# EAGLE design PE01 (EAGLE 6.3)
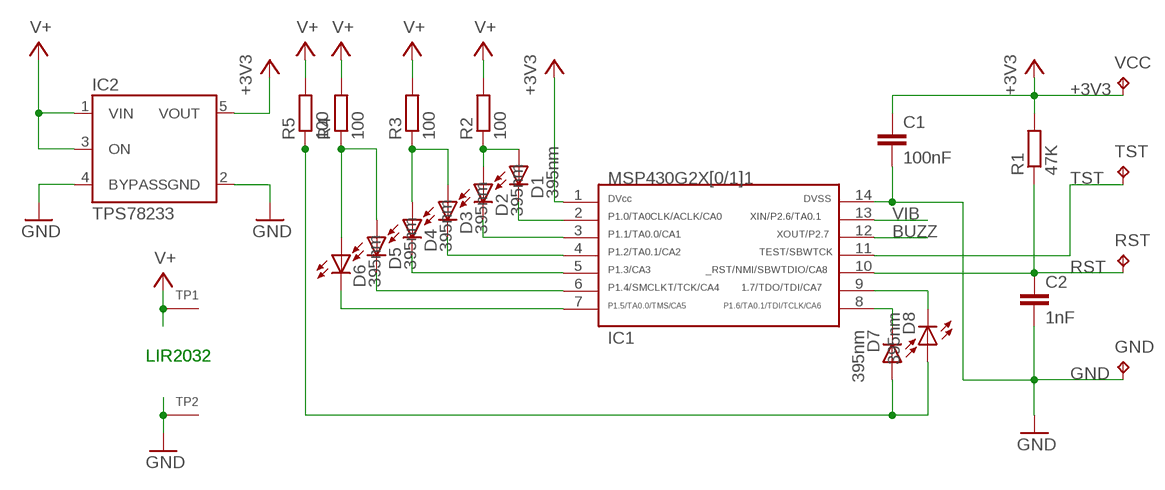
[diagram p0: schematic, sheet 1]

## Parts
C1  100nF  CAP0805  [0805]
C2  1nF  CAP0805  [0805]
D1  395nm  LED-3MM  [LED-3MM]
D2  395nm  LED-3MM  [LED-3MM]
D3  395nm  LED-3MM  [LED-3MM]
D4  395nm  LED-3MM  [LED-3MM]
D5  395nm  LED-3MM  [LED-3MM]
D6  395nm  LED-3MM  [LED-3MM]
D7  395nm  LED-3MM  [LED-3MM]
D8  395nm  LED-3MM  [LED-3MM]
GND  TPTP10R  [TP10R]
IC1  MSP430G2231  G2X[0/1]1---PW14  [PW14]
IC2  TPS78233  LP2982M5  [SOT23-5]
R1  47K  R-EU_R0603  [R0603]
R2  100  R-EU_R0603  [R0603]
R3  100  R-EU_R0603  [R0603]
R4  100  R-EU_R0603  [R0603]
R5  100  R-EU_R0603  [R0603]
RST  TPTP10R  [TP10R]
TP1  SEWTAP0.4IN  [SEWINGTAP_0.4]
TP2  SEWTAP0.4IN  [SEWINGTAP_0.4]
TST  TPTP10R  [TP10R]
VCC  TPTP10R  [TP10R]

## Nets
+3V3: C1.1 IC1.1 IC2.5(VOUT) R1.2 VCC.TP
BUZZ: IC1.12
GND: C1.2 C2.2 GND.TP IC1.14 IC2.2(GND) IC2.4(BYPASS)
N$1: D6.K(C) IC1.7
N$2: D5.K(C) IC1.6
N$3: D8.K(C) IC1.9
N$4: D7.K(C) IC1.8
N$5: D4.K(C) IC1.5
N$6: D3.K(C) IC1.4
N$7: D2.K(C) IC1.3
N$8: D1.K(C) IC1.2
N$10: D7.A D8.A R5.1
N$20: D3.A D4.A R3.1
N$21: D5.A D6.A R4.1
N$23: D1.A D2.A R2.1
RST: C2.1 IC1.10 R1.1 RST.TP
TST: IC1.11 TST.TP
V+: IC2.1(VIN) IC2.3(ON) R2.2 R3.2 R4.2 R5.2
VIB: IC1.13
Unconnected: TP1.TAP(SEW) TP2.TAP(SEW)

## Notes on the sheet
- LIR2032 | LIR2032

## Library data of the parts
C1 C2 = SparkFun:CAP: Capacitor Standard 0603 ceramic capacitor, and 0.1" leaded capacitor.
D1-D8 = dp_devices:LED: Light Emitting Diode
GND RST TST VCC = testpad:TP: Test pad
IC1 = TI_MSP430_v16:G2X[0/1]1---PW14: MSP430G2X[0/1]1 MSP430G2001, MSP430G2101, MSP430G2201,MSP430G2111, G2211 TSSOP (PW) 14 Pin Package http://focus.ti.com/docs/prod/folders/print/msp430g2111.html
IC2 = v-reg-3:LP2982: National Semiconductor <http://www.national.com> Micropower Linear Regulator 50mA regulated output, Vin 16V max., ultra-low dropout of 120mV @ 50mA, 1µA standby current, low noise
R1-R5 = rcl:R-EU_: RESISTOR, European symbol
TP1 TP2 = adafruit:SEWTAP

## Board
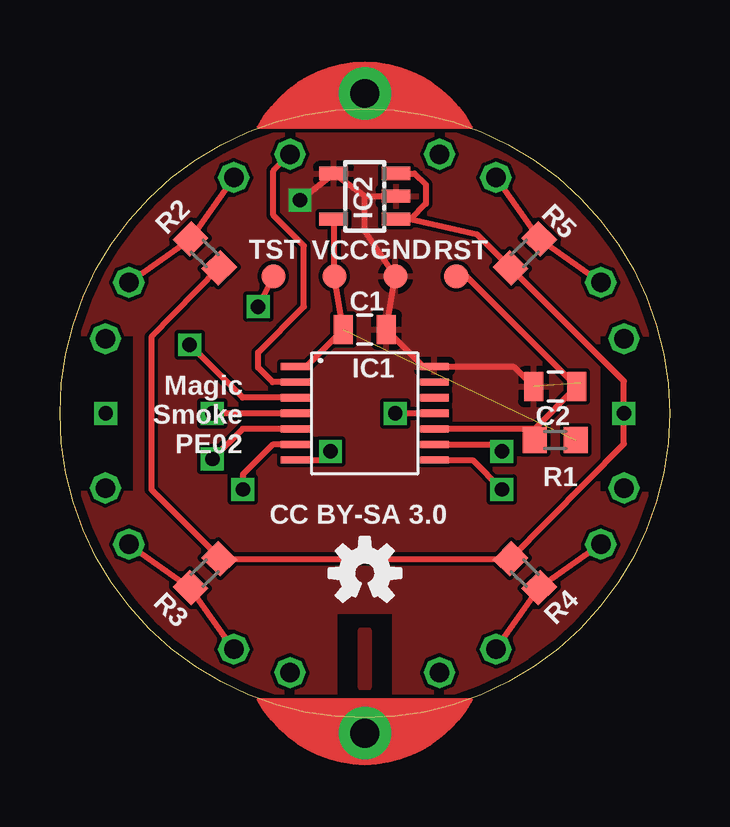
[diagram p1: board, top side]
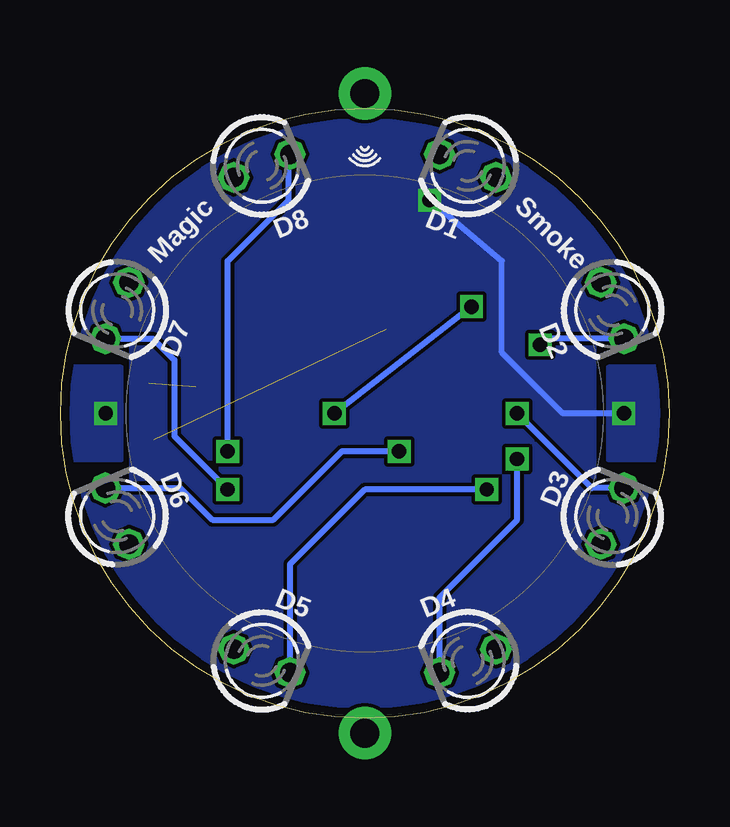
[diagram p2: board, bottom side, seen from below]

Size 25.4 x 25.4 mm. Coordinates in mm from the lower left corner, seen from the top.
Outline: 0,12.7 arc-180 25.4,12.7 arc-180 0,12.7
Copper layers (1*16): Top 0.0356mm / dielectric 1.5011mm / Bottom 0.0356mm
Design rules "LaenPCBOrder *": minimum track width 6mil, minimum drill 13mil, track to track 6mil, track to pad 6mil, pad to pad 6mil, via to via 6mil, smd to smd 6mil, copper to edge 15mil, drill to drill 6mil, minimum pad ring 7mil, minimum via ring 7mil, stop-mask expansion 3mil, vias tented up to drill 24mil, thermal gap 10mil

### Footprints (pad centres in the part's own frame; a part is rotated, then mirrored left to right if it is on the bottom)
0805 = smd 0.8 x 1.2: 1 -0.9,0; 2 0.9,0
LED-3MM = drill 0.813 octagon: A -1.27,0; K 1.27,0
TP10R = smd 1 x 1: TP 0,0
PW14 = smd 0.3 x 1.2: 1 -1.95,-2.9; 2 -1.3,-2.9; 3 -0.65,-2.9; 4 0,-2.9; 5 0.65,-2.9; 6 1.3,-2.9; 7 1.95,-2.9; 8 1.95,2.9; 9 1.3,2.9; 10 0.65,2.9; 11 0,2.9; 12 -0.65,2.9; 13 -1.3,2.9; 14 -1.95,2.9
SOT23-5 = smd 0.55 x 1.2: 1 -0.95,-1.3; 2 0,-1.3; 3 0.95,-1.3; 4 0.95,1.3; 5 -0.95,1.3
R0603 = smd 1 x 1.1: 1 -0.85,0; 2 0.85,0
SEWINGTAP_0.4 = drill 1.2 pad 2.184: TAP 0,0

### Placement (x,y rotation side)
C1  12.7,16.19 0 top
C2  20.64,13.81 180 top
D1  8.41,23.02 157.5 bottom
D2  2.38,16.99 292.5 bottom
D3  2.38,8.41 67.5 bottom
D4  8.41,2.38 202.5 bottom
D5  16.99,2.38 337.5 bottom
D6  23.02,8.41 112.5 bottom
D7  23.02,16.99 247.5 bottom
D8  16.99,23.02 22.5 bottom
GND  13.97,18.41 210 top
IC1  12.7,12.7 270 top
IC2  12.7,21.75 90 top
R1  20.64,11.59 0 top
R2  6.03,19.37 315 top
R3  6.03,6.03 45 top
R4  19.37,6.03 135 top
R5  19.37,19.37 225 top
RST  16.51,18.41 150 top
TP1  12.7,26.04 0 top
TP2  12.7,-0.63 180 top
TST  8.89,18.41 210 top
U$1  [OSHW-LOGO-S]  12.7,6.03 0 top
VCC  11.43,18.41 150 top

### Tracks (layer width: path | path; a pad name or v marks a point on that pad's centre or on a via)
+3V3  (1 unrouted)
  Top 0.254: IC2.5 11.43,20.77 VCC.TP C1.1 10.26,14.65 IC1.1
GND  (via drill 0.6)  (1 unrouted)
  Top 0.254: 12.7,21.75 12.7,20.32 GND.TP C1.2 15.14,14.65 IC1.14 18.9,14.65 C2.2 | 12.7,21.75 IC2.2 | 12.7,21.75 IC2.4 v10,21.59
  Bottom 0.254: v1.91,12.7 4.45,12.7 6.98,15.24 6.98,19.05 v10,21.59
  pour Bottom: -5.08,25.4 -5.08,16.03 3.17,16.03 3.17,9.37 -5.24,9.37 -5.08,0 30.48,0 30.48,9.21 22.38,9.37 22.38,16.03 30.48,15.88 30.48,25.4
  pour Top: -6.35,25.08 31.75,25.08 31.75,15.88 22.38,16.03 22.38,9.37 31.75,9.21 31.75,0 13.97,0 13.97,4.45 11.43,4.45 11.43,0 -6.35,0 -6.35,9.37 3.17,9.37 3.17,16.03 -6.35,16.03
  pour Bottom: 0,14.6 2.54,14.6 2.54,10.8 0,10.8
N$1  (via drill 0.6)
  Top 0.254: IC1.7 10.91,10.75 v11.27,11.11
  Bottom 0.254: D6.K 20.38,9.59 19.05,8.26 16.51,8.26 13.65,11.11 v11.27,11.11
N$2  (via drill 0.6)
  Top 0.254: IC1.6 8.86,11.4 7.62,10.16 v7.62,9.52
  Bottom 0.254: v7.62,9.52 12.7,9.52 15.81,6.41 D5.K
N$3  (via drill 0.6)
  Top 0.254: IC1.9 18.13,11.4 v18.41,11.11
  Bottom 0.254: v18.41,11.11 18.41,19.05 15.88,21.59 15.88,23.44 D8.K
N$4  (via drill 0.6)
  Top 0.254: IC1.8 17.19,10.75 v18.41,9.52
  Bottom 0.254: D7.K 21.53,15.81 20.64,14.92 20.64,11.75 v18.41,9.52
N$5  (via drill 0.6)
  Top 0.254: IC1.5 7.6,12.05 v6.35,10.8
  Bottom 0.254: D4.K 9.59,5.02 6.35,8.26 v6.35,10.8
N$6  (via drill 0.6)
  Top 0.254: IC1.4 v6.35,12.7
  Bottom 0.254: D3.K 3.24,9.59 v6.35,12.7
N$7  (via drill 0.6)
  Top 0.254: IC1.3 7.6,13.35 v5.4,15.56
  Bottom 0.254: D2.K 5.14,15.81 v5.4,15.56
N$8
  Top 0.254: IC1.2 8.86,14 8.25,14.6 8.25,15.24 10.16,17.15 10.16,19.69 8.89,20.96 8.89,22.81 D1.K
N$10
  Top 0.254: D8.A R5.1 D7.A
N$20
  Top 0.254: D3.A R3.1 D4.A
N$21
  Top 0.254: D5.A R4.1 D6.A
N$23
  Top 0.254: D1.A R2.1 D2.A
RST
  Top 0.254: IC1.10 15.62,12.06 19.68,12.06 19.79,11.96 R1.1 19.74,11.64 19.74,12.01 C2.1 16.93,18.41 RST.TP
TST  (via drill 0.6)
  Top 0.254: IC1.11 v13.97,12.7 | TST.TP v8.25,17.15
  Bottom 0.254: v8.25,17.15 v13.97,12.7
V+  (via drill 0.6)
  Top 0.254: IC2.1 14.6,20.8 | 14.6,20.8 17.37,20.16 R5.2 23.49,14.04 v23.49,12.7 23.49,11.43 R4.2 R3.2 6.63,6.7 3.81,9.52 3.81,15.88 R2.2 | IC2.3 14.77,22.7 15.24,22.23 15.24,21.43 14.6,20.8
  pour Bottom: 22.86,14.6 25.4,14.6 25.4,10.8 22.86,10.8
VIB
  pour Top: 12.86,1.27 12.54,1.27 12.54,3.65 12.86,3.65

### Text on the board
tPlace: Magic / Smoke / PE02 | CC BY-SA 3.0
bPlace: Smoke | Magic